# Altium schematic sheet NDMK.SchDoc
size A4
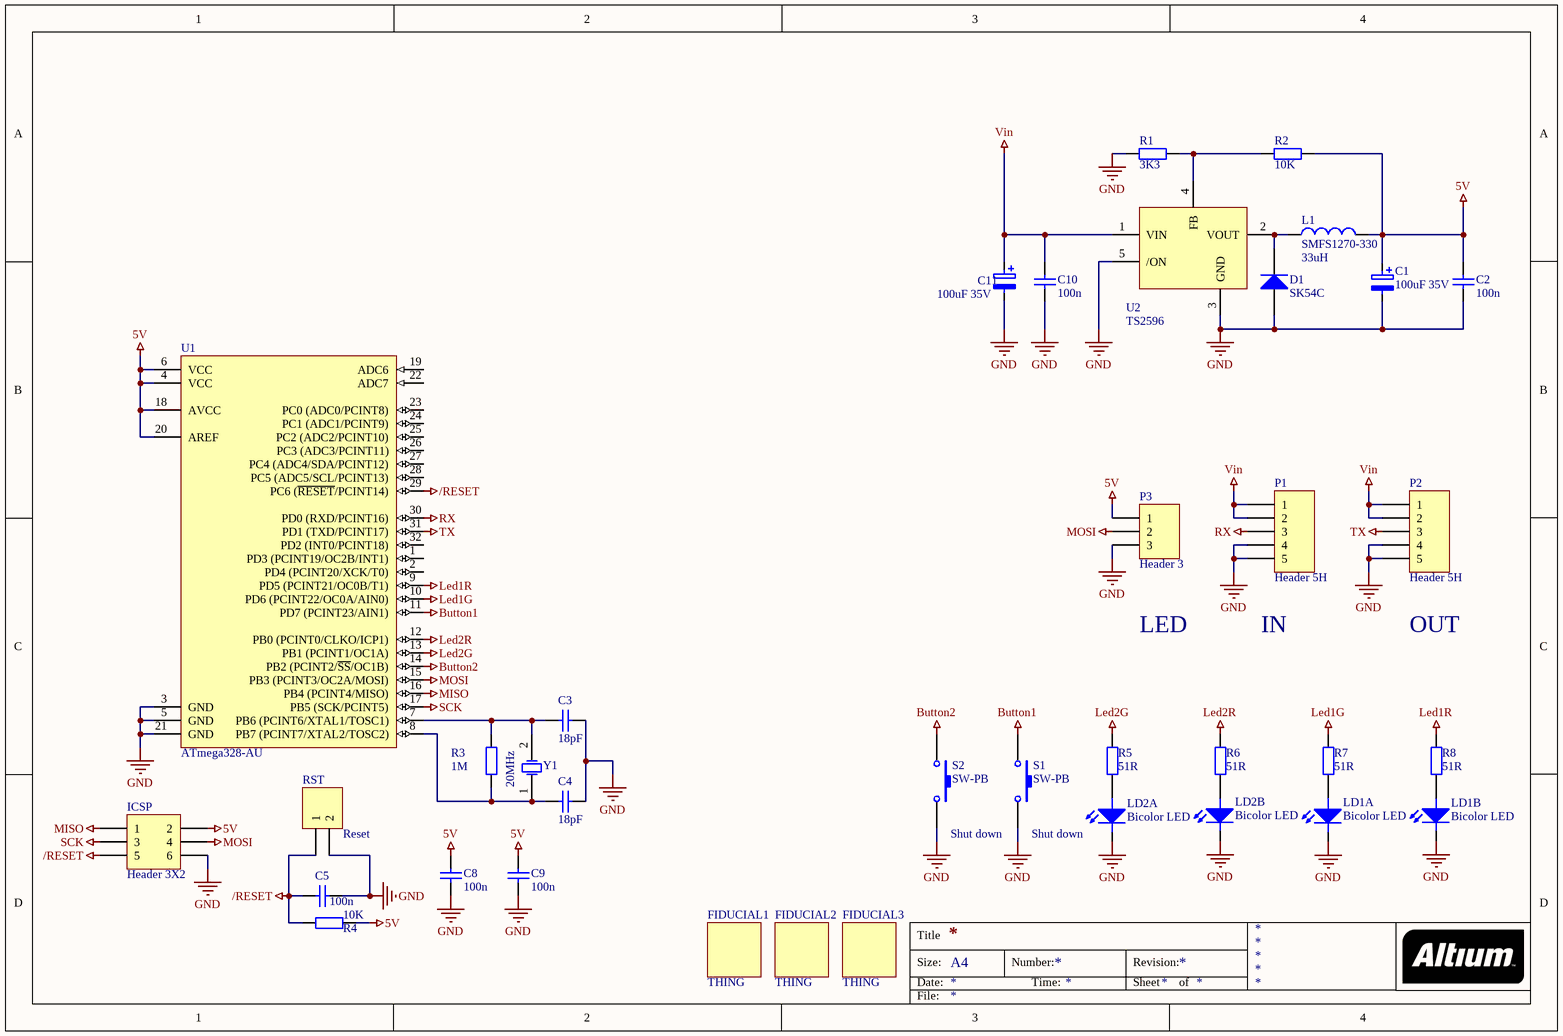
[diagram p0: NDMK.SchDoc]

## Parts
C1  100uF 35V  [CAPSMD0605]
C2  100n  [C1206]
C3  18pF  [C1206]
C4  18pF  [C1206]
C5  100n  [C1206]
C8  100n  [C1206]
C9  100n  [C1206]
C10  100n  [C1206]
C11  100uF 35V  [SMD 1010]
D1  SK54C  [D-SMC]
FIDUCIAL1  THING  [FIDUCIAL]  (no BOM)
FIDUCIAL2  THING  [FIDUCIAL]  (no BOM)
FIDUCIAL3  THING  [FIDUCIAL]  (no BOM)
ICSP  Header 3X2  [HDR2X3]
L1  SMFS1270-330  value 33uH  [smd1212]
LD1  Bicolor LED  [11-22SURSYGC]  (parts A,B of 2)
LD2  Bicolor LED  [11-22SURSYGC]  (parts A,B of 2)
P1  Header 5H  [HDR1X5H]
P2  Header 5H  [HDR1X5H]
P3  Header 3  [HDR1X3]
R1  3K3  [R1206]
R2  10K  [R1206]
R3  1M  [R1206]
R4  10K  [R1206]
R5  51R  [R1206]
R6  51R  [R1206]
R7  51R  [R1206]
R8  51R  [R1206]
RST  Reset  [HDR1X2]  (no BOM)
S1  SW-PB  [MULTICOMP - MC32850 - SWITCH]
S2  SW-PB  [MULTICOMP - MC32850 - SWITCH]
U1  ATmega328-AU  [32A_N]
U2  TS2596  [TO-263-5L]
Y1  20MHz  [xtal]

## Nets
5V: C1.1 C2.2 C8.2 C9.2 ICSP.2 L1.2 P3.1 R2.1 R4.2 U1.4(VCC) U1.6(VCC) U1.18(AVCC) U1.20(AREF)
/RESET: C5.2 ICSP.5 R4.1 RST.1 U1.29(PC6_(~{RESET}/PCINT14))
Button1: S1.1 U1.11(PD7_(PCINT23/AIN1))
Button2: S2.1 U1.14(PB2_(PCINT2/~{SS}/OC1B))
GND: C1.2 C2.1 C3.2 C4.2 C5.1 C8.1 C9.1 C10.1 C11.2 D1.1(A) ICSP.6 LD1.1 LD1.3 LD2.1 LD2.3 P1.4 P1.5 P2.4 P2.5 P3.3 R1.2 RST.2 S1.2 S2.2 U1.3(GND) U1.5(GND) U1.21(GND) U2.3(GND) U2.5(/ON)
Led1G: R7.2 U1.10(PD6_(PCINT22/OC0A/AIN0))
Led1R: R8.2 U1.9(PD5_(PCINT21/OC0B/T1))
Led2G: R5.2 U1.13(PB1_(PCINT1/OC1A))
Led2R: R6.2 U1.12(PB0_(PCINT0/CLKO/ICP1))
MISO: ICSP.1 U1.16(PB4_(PCINT4/MISO))
MOSI: ICSP.4 P3.2 U1.15(PB3_(PCINT3/OC2A/MOSI))
RX: P1.3 U1.30(PD0_(RXD/PCINT16))
SCK: ICSP.3 U1.17(PB5_(SCK/PCINT5))
TX: P2.3 U1.31(PD1_(TXD/PCINT17))
Vin: C10.2 C11.1 P1.1 P1.2 P2.1 P2.2 U2.1(VIN)
NetC3_1: C3.1 R3.2 U1.7(PB6_(PCINT6/XTAL1/TOSC1)) Y1.2(OSC2)
NetC4_1: C4.1 R3.1 U1.8(PB7_(PCINT7/XTAL2/TOSC2)) Y1.1(OSC1)
NetD1_2: D1.2(K) L1.1 U2.2(VOUT)
NetLD1_2: LD1.2 R8.1
NetLD1_4: LD1.4 R7.1
NetLD2_2: LD2.2 R6.1
NetLD2_4: LD2.4 R5.1
NetR1_1: R1.1 R2.2 U2.4(FB)

Not connected (* = marked no-connect by the designer): U1 1(PD3_(PCINT19/OC2B/INT1)) 2(PD4_(PCINT20/XCK/T0)) 19(ADC6) 22(ADC7) 23(PC0_(ADC0/PCINT8)) 24(PC1_(ADC1/PCINT9)) 25(PC2_(ADC2/PCINT10)) 26(PC3_(ADC3/PCINT11)) 27(PC4_(ADC4/SDA/PCINT12)) 28(PC5_(ADC5/SCL/PCINT13)) 32(PD2_(INT0/PCINT18))

## Notes on the sheet
- LED
- IN
- OUT
- Shut down
- Title
- Size:
- Date:
- A4
- Number:
- Time:
- Revision:
- Sheet
- of
- File:

## Library data of the parts
C1 C11 = CapPol _1: Polarised Capacitator
C2 C5 C8-C10 = Cap: Capacitor; Value: 100pF; Published: 8-Jun-2000; LatestRevisionDate: 17-Jul-2002; LatestRevisionNote: Re-released for DXP Platform.; PackageReference: RAD-0.3; Publisher: Altium Limited
C3 C4 = Cap Semi: Capacitor (Semiconductor SIM Model); Value: 100pF; Published: 8-Jun-2000; LatestRevisionDate: 29-May-2009; LatestRevisionNote: IPC-7351 Footprint Added.; PackageReference: C1206; Publisher: Altium Limited; PackageDescription: Chip Capacitor
D1 = Diode: Default Diode; Published: 8-Jun-2000; LatestRevisionDate: 17-Jul-2002; LatestRevisionNote: Re-released for DXP Platform.; PackageVersion: Sep-1996; PackageReference: SMC; Publisher: Altium Limited; PackageDescription: DO-214-AB/SMC; 2 C-Bend Leads; Body 7.9 x 5.9 mm, inc. leads (LxW); Code_JEDEC: DO-214-AB
FIDUCIAL1-FIDUCIAL3 = THING: Something
ICSP = Header 3X2: Header, 3-Pin, Dual row; LatestRevisionDate: 17-Jul-2002; LatestRevisionNote: Re-released for DXP Platform.; Publisher: Altium Limited
L1 = Inductor: Code_IEC: 1005; Published: 8-Jun-2000; LatestRevisionDate: 29-May-2009; LatestRevisionNote: IPC-7351 Footprint Added.; PackageReference: 0402-A; Publisher: Altium Limited; PackageDescription: Chip Inductor; Code_JEITA: 0402
LD1 LD2 = Bicolor LED: 11-22SURSYGC/S530-A2/TR8
P1 P2 = Header 5H: Header, 5-Pin, Right Angle; LatestRevisionDate: 17-Jul-2002; LatestRevisionNote: Re-released for DXP Platform.; Publisher: Altium Limited
P3 = Header 3: Header, 3-Pin; LatestRevisionDate: 17-Jul-2002; LatestRevisionNote: Re-released for DXP Platform.; Publisher: Altium Limited
R1-R8 = Res2: Resistor; Published: 8-Jun-2000; LatestRevisionDate: 17-Jul-2002; LatestRevisionNote: Re-released for DXP Platform.; PackageReference: AXIAL-0.4; Publisher: Altium Limited; PackageDescription: Axial Device, Thru-Hole; 2 Leads; 0.4 in Pin Spacing
  R1: Value: 3K3
  R2 R4: Value: 10K
  R3: Value: 1M
  R5-R8: Value: 51R
RST = Header 2: DO NOT POPULATE; LatestRevisionDate: 17-Jul-2002; LatestRevisionNote: Re-released for DXP Platform.; Publisher: Altium Limited
S1 S2 = SW-PB: Switch; Published: 24-Mar-1999; LatestRevisionDate: 17-Jul-2002; LatestRevisionNote: Re-released for DXP Platform.; PackageReference: SPST-2; Publisher: Altium Limited; PackageDescription: Switch; 2 Leads
U1 = ATmega328-AU: 8-bit AVR Microcontroller, 32KB Flash, 1KB EEPROM, 2KB SRAM, 32-pin TQFP, Industrial Grade (-40°C to 85°C); Published: 1-Apr-2010; DatasheetVersion: revA, Jan-2010; PackageVersion: revB, Oct-2001; PackageReference: 32A; Publisher: Altium Limited; PackageDescription: 32-Lead, 7x7x1.0 mm Body, 0.8mm Lead Pitch, Thin Profile Plastic Quad Flat Package (TQFP); Supplier 1: Digi-Key; Supplier Part Number 1: ATMEGA328-AU-ND; Supplier 2: Mouser; Supplier Part Number 2: 556-ATMEGA328-AU; Code_JEDEC: MS-026-ABA; ComponentLink1Description: Manufacturer Link; ComponentLink1URL: http://www.atmel.com/products/avr/default.asp?; ComponentLink2Description: ATmega48A/48PA/88A/88PA/168A/168PA/328/328P Datasheet; ComponentLink2URL: http://www.atmel.com/dyn/resources/prod_documents/8271.pdf; ComponentLink3Description: ATmega48A/48PA/88A/88PA/168A/168PA/328/328P Summary; ComponentLink3URL: http://www.atmel.com/dyn/resources/prod_documents/8271S.pdf; ComponentLink4Description: Atmel.com Home; ComponentLink4URL: http://www.atmel.com
U2 = TS2596: 3A / 150KHz Buck DC-DC Converter
Y1 = XTAL: Crystal Oscillator; Published: 8-Jun-2000; LatestRevisionDate: 17-Jul-2002; LatestRevisionNote: Re-released for DXP Platform.; PackageReference: R38; Publisher: Altium Limited